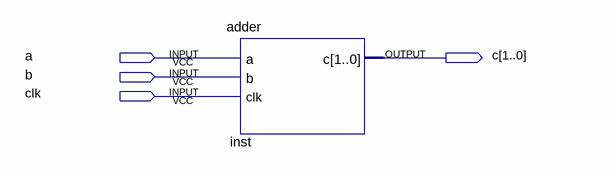
[diagram p0: schematic sheet]
// Quartus schematic Block1.bdf as structural Verilog: 1 symbols, 4 pins
module Block1 (
  input  a,
  input  b,
  input  clk,
  output [1:0] c
);

  adder inst (.a(a), .b(b), .clk(clk), .c(c));
endmodule
